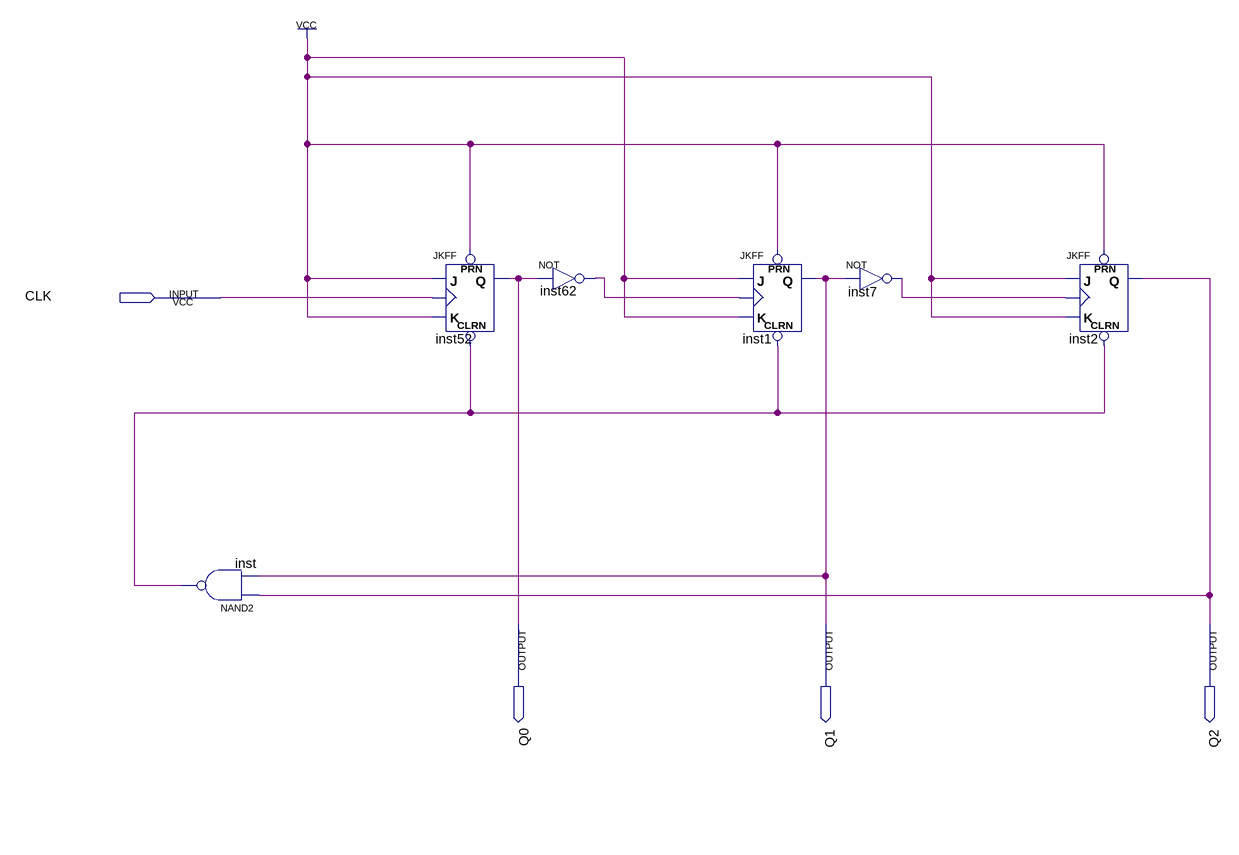
[diagram p0: schematic sheet]
// Quartus schematic ModOchoTruncadoSeis.bdf as structural Verilog: 6 symbols, 4 pins
module ModOchoTruncadoSeis (
  input  CLK,
  output Q0,
  output Q1,
  output Q2
);

  wire inst7_out, inst62_out, inst_out;

  nand inst (inst_out, Q2, Q1);
  JKFF inst52 (.PRN(1'b1), .CLRN(inst_out), .K(1'b1), .J(1'b1), .CLK(CLK), .Q(Q0));
  not inst62 (inst62_out, Q0);
  JKFF inst1 (.PRN(1'b1), .CLRN(inst_out), .K(1'b1), .J(1'b1), .CLK(inst62_out), .Q(Q1));
  not inst7 (inst7_out, Q1);
  JKFF inst2 (.PRN(1'b1), .CLRN(inst_out), .K(1'b1), .J(1'b1), .CLK(inst7_out), .Q(Q2));
endmodule
